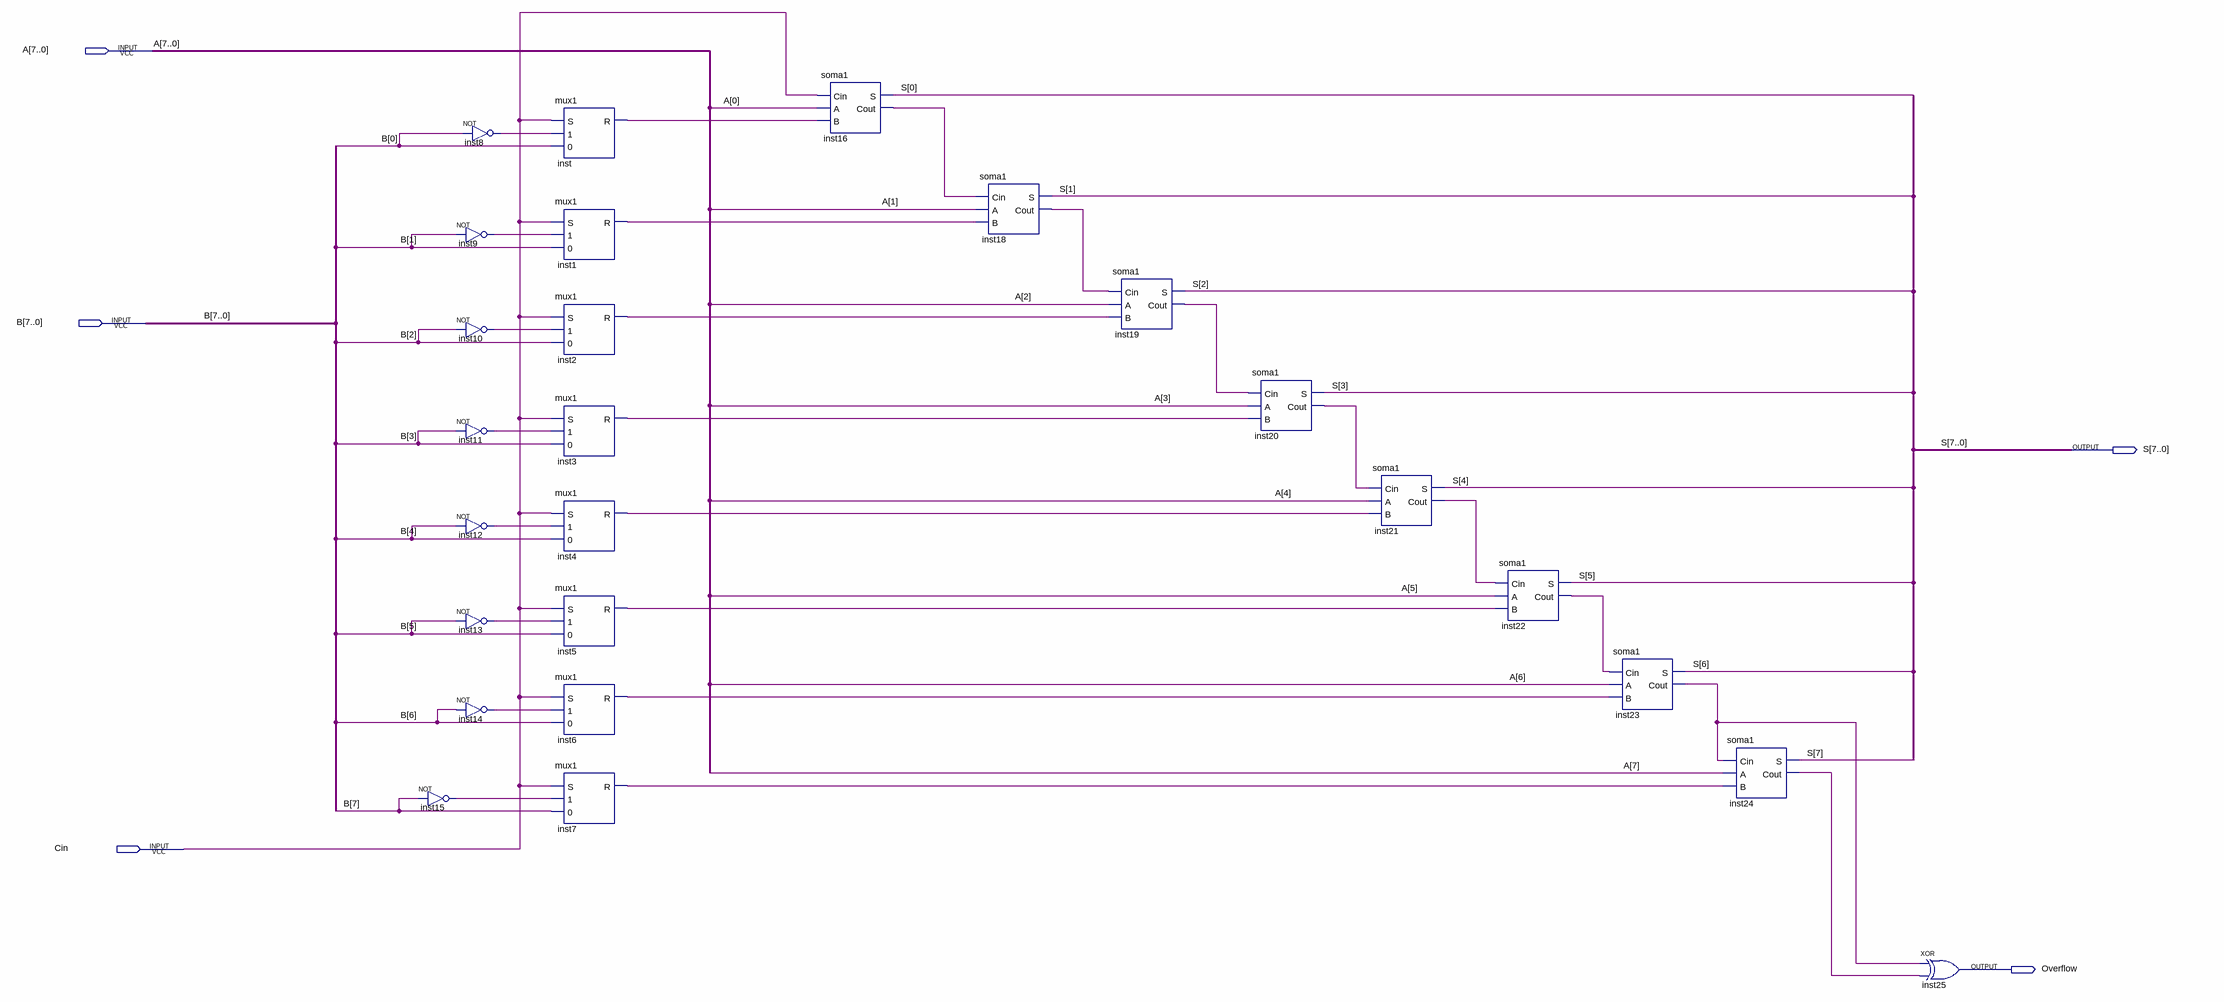
[diagram p0: schematic sheet]
// Quartus schematic somasub8.bdf as structural Verilog: 25 symbols, 5 pins
module somasub8 (
  input  [7:0] A,
  input  [7:0] B,
  input  Cin,
  output [7:0] S,
  output Overflow
);

  wire inst1_r, inst2_r, inst3_r, inst4_r, inst5_r, inst6_r, inst7_r, inst8_out, inst9_out, inst10_out,
       inst11_out, inst12_out, inst13_out, inst14_out, inst15_out, inst16_cout, inst18_cout, inst19_cout,
       inst20_cout, inst21_cout, inst22_cout, inst23_cout, inst24_cout, inst_r;

  not inst15 (inst15_out, B[7]);
  not inst8 (inst8_out, B[0]);
  not inst9 (inst9_out, B[1]);
  not inst10 (inst10_out, B[2]);
  not inst11 (inst11_out, B[3]);
  not inst12 (inst12_out, B[4]);
  not inst13 (inst13_out, B[5]);
  not inst14 (inst14_out, B[6]);
  mux1 inst (.S(Cin), .\1 (inst8_out), .\0 (B[0]), .R(inst_r));
  mux1 inst1 (.S(Cin), .\1 (inst9_out), .\0 (B[1]), .R(inst1_r));
  mux1 inst2 (.S(Cin), .\1 (inst10_out), .\0 (B[2]), .R(inst2_r));
  mux1 inst3 (.S(Cin), .\1 (inst11_out), .\0 (B[3]), .R(inst3_r));
  mux1 inst4 (.S(Cin), .\1 (inst12_out), .\0 (B[4]), .R(inst4_r));
  mux1 inst5 (.S(Cin), .\1 (inst13_out), .\0 (B[5]), .R(inst5_r));
  mux1 inst6 (.S(Cin), .\1 (inst14_out), .\0 (B[6]), .R(inst6_r));
  mux1 inst7 (.S(Cin), .\1 (inst15_out), .\0 (B[7]), .R(inst7_r));
  soma1 inst16 (.Cin(Cin), .A(A[0]), .B(inst_r), .S(S[0]), .Cout(inst16_cout));
  soma1 inst18 (.Cin(inst16_cout), .A(A[1]), .B(inst1_r), .S(S[1]), .Cout(inst18_cout));
  soma1 inst19 (.Cin(inst18_cout), .A(A[2]), .B(inst2_r), .S(S[2]), .Cout(inst19_cout));
  soma1 inst20 (.Cin(inst19_cout), .A(A[3]), .B(inst3_r), .S(S[3]), .Cout(inst20_cout));
  soma1 inst21 (.Cin(inst20_cout), .A(A[4]), .B(inst4_r), .S(S[4]), .Cout(inst21_cout));
  soma1 inst22 (.Cin(inst21_cout), .A(A[5]), .B(inst5_r), .S(S[5]), .Cout(inst22_cout));
  soma1 inst23 (.Cin(inst22_cout), .A(A[6]), .B(inst6_r), .S(S[6]), .Cout(inst23_cout));
  soma1 inst24 (.Cin(inst23_cout), .A(A[7]), .B(inst7_r), .S(S[7]), .Cout(inst24_cout));
  xor inst25 (Overflow, inst23_cout, inst24_cout);
endmodule
